# Altium schematic sheet H_Bridge.SchDoc
size A4; SheetNumber: 1; SheetTotal: 1
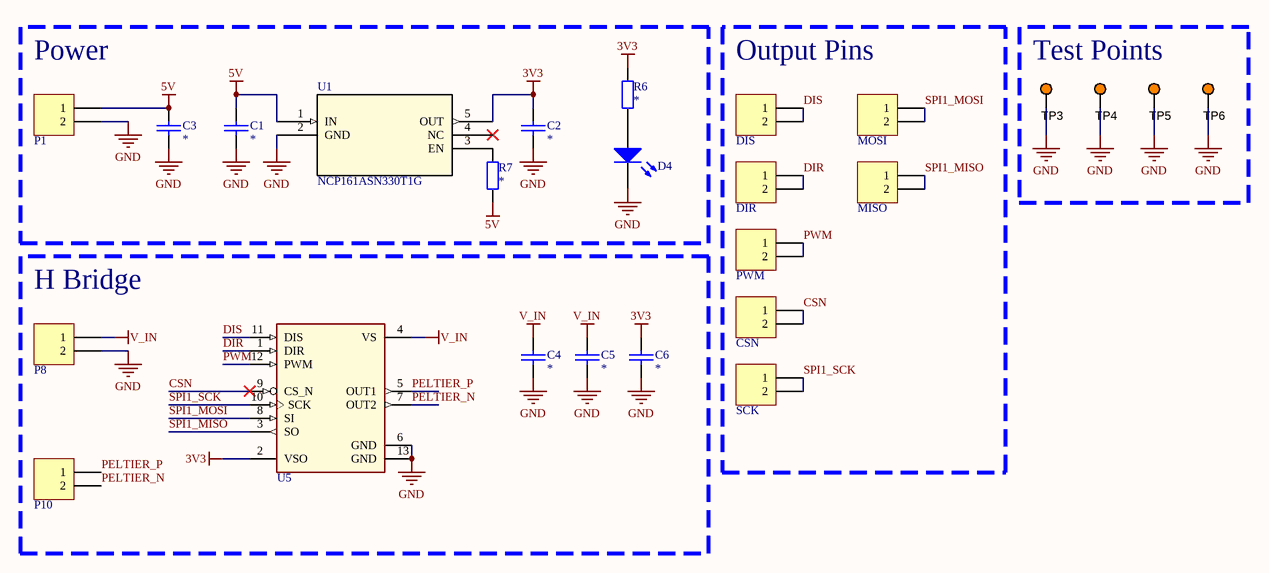
[diagram p0: H_Bridge.SchDoc]

## Parts
C1  *  [0805 CAP]
C2  *  [0805 CAP]
C3  *  [0805 CAP]
C4  *  [0805 CAP]
C5  *  [0805 CAP]
C6  *  [0805 CAP]
CSN  2 Way  [ECE-600102STTH]  (value not drawn)
D4  LTST-C170KGKT  [0805 LED]  (value not drawn)
DIR  2 Way  [ECE-600102STTH]  (value not drawn)
DIS  2 Way  [ECE-600102STTH]  (value not drawn)
MISO  2 Way  [ECE-600102STTH]  (value not drawn)
MOSI  2 Way  [ECE-600102STTH]  (value not drawn)
P1  2 Way  [ECE-600102STTH]  (value not drawn)
P8  2 Way  [ECE-600102STTH]  (value not drawn)
P10  2 Way  [ECE-600102STTH]  (value not drawn)
PWM  2 Way  [ECE-600102STTH]  (value not drawn)
R6  *  [0805 RES]
R7  *  [0805 RES]
SCK  2 Way  [ECE-600102STTH]  (value not drawn)
TP3  5003  [TP_TH]  (value not drawn)
TP4  5003  [TP_TH]  (value not drawn)
TP5  5003  [TP_TH]  (value not drawn)
TP6  5003  [TP_TH]  (value not drawn)
U1  NCP161ASN330T1G  [SOT23_527AH_ONS]
U5  IFX9201SG  [SOP100P1030X260-13N]  (value not drawn)

## Blocks framed on the sheet
Power: C1-C3 D4 P1 R6 R7 U1
Output Pins: CSN DIR DIS MISO MOSI PWM SCK
Test Points: TP3-TP6
H Bridge: C4-C6 P8 P10 U5

## Nets
3V3: C2.1 C6.1 R6.1 U1.5(OUT) U5.2(VSO)
5V: C1.1 C3.1 P1.1 R7.2 U1.1(IN)
GND: C1.2 C2.2 C3.2 C4.2 C5.2 C6.2 D4.2(K) P1.2 P8.2 TP3.1 TP4.1 TP5.1 TP6.1 U1.2(GND) U5.6(GND) U5.13(GND)
V_IN: C4.1 C5.1 P8.1 U5.4(VS)
CSN: CSN.1 CSN.2 U5.9(CS_N)
DIR: DIR.1 DIR.2 U5.1(DIR)
DIS: DIS.1 DIS.2 U5.11(DIS)
PELTIER_N: P10.2 U5.7(OUT2)
PELTIER_P: P10.1 U5.5(OUT1)
PWM: PWM.1 PWM.2 U5.12(PWM)
SPI1_MISO: MISO.1 MISO.2 U5.3(SO)
SPI1_MOSI: MOSI.1 MOSI.2 U5.8(SI)
SPI1_SCK: SCK.1 SCK.2 U5.10(SCK)
NetD4_1: D4.1(A) R6.2
NetR7_1: R7.1 U1.3(EN)

Not connected (* = marked no-connect by the designer): U1 4(NC)*

## Library data of the parts
C1-C6 = CerCap_SMT_0805: SMT ceramic capacitor 0805 size; Value: *
CSN DIR DIS MISO MOSI P1 P8 P10 PWM SCK = CON000001: HEADER POLARISED 2WAY TH; Manufactuer: GTK; Manufacturer-PN: 600102ST; Assembly Method: Through hole; Item Type: Item; Path: ece/ts/Lists/Stock Inventory; UoA Stock#: CON000001; Value: 2 Way; Size/Package: 2.54 Radial; Datasheet Link: http://share.engineering.auckland.ac.nz/ece/ts/Student%20Documents/polarised_connectors.pdf; Supplier1: Elecon; Supplier1-PN: YY3N02; Supplier2: Active Components; Supplier2-PN: 600102ST; Component Type: NA; Category: Connector; Status: Active
D4 = LED_SMT_0805: SMT LED 0805 size; Manufacturer: Lite-On Inc.; Color: Green; Lens Color: Colorless; Lens Transparency: Clear; Millicandela Rating: 35mcd; Lens Style/Size: Rectangle with Flat Top, 1.40mm x 1.25mm; Voltage - Forward (Vf) (Typ): 2V; Current - Test: 20mA; Viewing Angle: 130°; Wavelength - Dominant: 571nm; Wavelength - Peak: 574nm; Supplier 1: Digi-Key; Manufacturer Part Number: LTST-C170KGKT; RoHS: RoHS Compliant; Category: Optoelectronics; Stock 1: 503069; Pricing 1: 1=0.62, 10=0.459, 25=0.338, 100=0.2415, 250=0.16416, 500=0.14486, 1000=0.11347 (NZD); Packaging: Cut Tape (CT); Part Status: Active; Mounting Type: Surface Mount; Features: -; Package / Case: 0805 (2012 Metric); Size / Dimension: 2.00mm L x 1.25mm W; Height (Max): 1.10mm; ComponentLink1URL: http://optoelectronics.liteon.com/upload/download/DS22-2000-073/LTST-C170KGKT.pdf; ComponentLink1Description: http://optoelectronics.liteon.com/upload/download/DS22-2000-073/LTST-C170KGKT.pdf; Supplier Part Number 1: 160-1414-1-ND
R6 R7 = Res_SMT_0805: 0805 resistor; Published: 8-Jun-2000; LatestRevisionDate: 17-Jul-2002; LatestRevisionNote: Re-released for DXP Platform.; PackageReference: AXIAL-0.4; Publisher: Altium Limited; Value: *; ComponentLink1Description: https://nz.mouser.com/datasheet/2/315/AOA0000C304-1149620.pdf
TP3-TP6 = TestPoint: Test Point, Orange, 1-Pin THD, RoHS; Peak Reverse Current: 600 uA; Forward Current: 3 A; Max Surge Current: 80 A; Forward Voltage: 1.08 V; Max Operating Temperature: 150 degC; PackageReference: 5003; Pins: 2; ComponentLink2URL: http://keyelco.com/userAssets/file/M65p56.pdf; PackageDescription: 1-Pin Through Hole Device, Dia 2.54 mm; Weight: 0.01 lb; Diameter: 5.3 mm; Mount: Through Hole; Package Quantity: 500; Packaging: Bulk; Min Operating Temperature: -65 degC; ComponentLink1Description: Manufacturer URL; Height: 0.25 inch; ComponentLink1URL: http://www.keyelco.com/; ComponentLink2Description: Datasheet; Width: 0.25 inch; REACH SVHC: No SVHC; RoHSCompliant: true; Radiation Hardening: No; Length: 9.5 mm; DatasheetVersion: Jun-15
U1 = NCP161ASN330T1G: Description; Manufacturer_Name: onsemi; Copyright: Copyright (C) 2026 Ultra Librarian. All rights reserved.; Manufacturer_Part_Number: NCP161ASN330T1G; RefDes: RefDes; Type: Type
U5 = IFX9201SG: 6 A H-Bridge with SPI; Manufacturer: Infineon Technologies; ManufacturerPartNumber: IFX9201SG; PackageReference: PG-DSO-12-17